# Altium project Length Bar Comparator.PrjPcb (part 3 of 3)

## Sheet Power Regulation.SchDoc
size A3
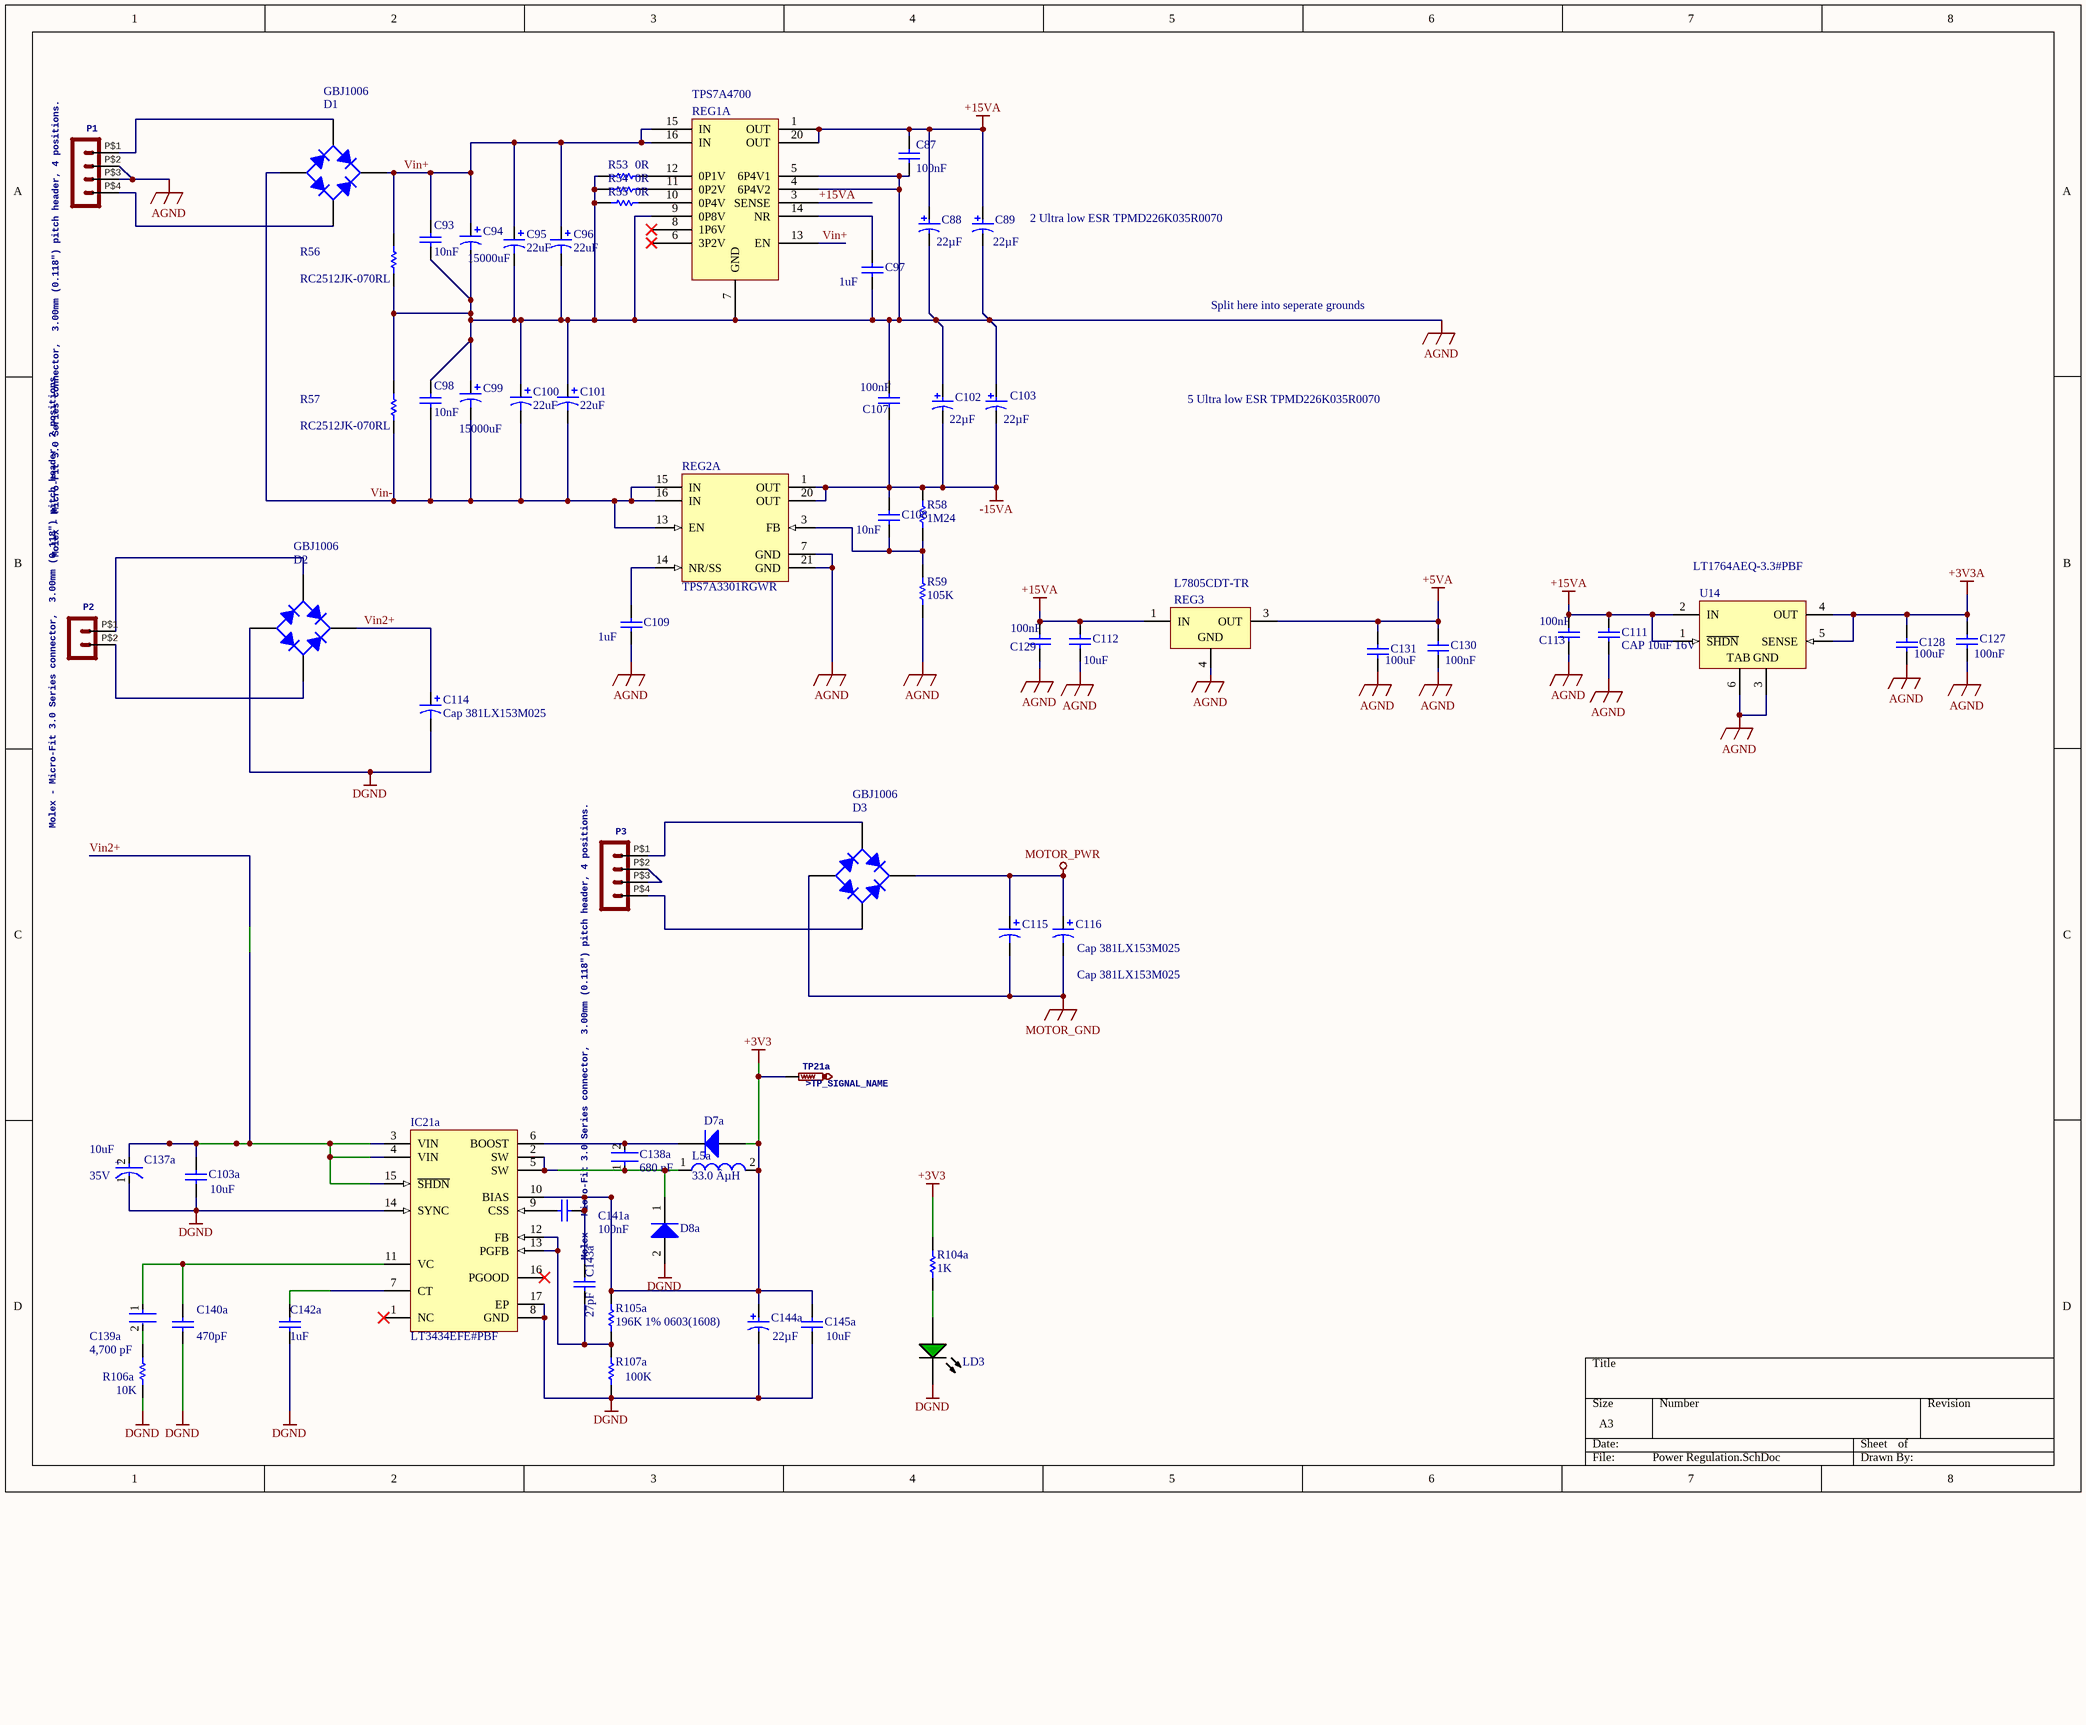
[diagram p9: Power Regulation.SchDoc]

### Parts
C87  value 100nF  [CAPC1206(3216)190_N]  (hidden comment: CAP 100nF 25V 1206(3216))
C88  Capacitance: 22µF  [CAPMP6032X28-T_V]  (hidden comment: TPSC226K025R0275)
C89  Capacitance: 22µF  [CAPMP6032X28-T_V]  (hidden comment: TPSC226K025R0275)
C93  value 10nF  [C0805]  (hidden comment: l)
C94  value 15000uF  [Cap 15000uF]  (hidden comment: Cap 381LX153M025)
C95  22uF  [Case D]
C96  22uF  [Case D]
C97  value 1uF  [C1206]  (hidden comment: l)
C98  value 10nF  [C0805]  (hidden comment: l)
C99  value 15000uF  [Cap 15000uF]  (hidden comment: Cap 381LX153M025)
C100  22uF  [Case D]
C101  22uF  [Case D]
C102  Capacitance: 22µF  [CAPMP6032X28-T_V]  (hidden comment: TPSC226K025R0275)
C103  Capacitance: 22µF  [CAPMP6032X28-T_V]  (hidden comment: TPSC226K025R0275)
C103a  Capacitance: 10uF  [CAPC3225X280X20LL40]  (hidden comment: CGA6P3X7S1H106K250AB)
C107  value 100nF  [CAPC1206(3216)190_N]  (hidden comment: CAP 100nF 25V 1206(3216))
C108  value 10nF  [C0805]  (hidden comment: l)
C109  value 1uF  [C1206]  (hidden comment: l)
C111  CAP 10uF 16V 1210(3225)  [CAPC1210(3225)230_N]
C112  value 10uF  [CAPC1210(3225)230_N]  (hidden comment: CAP 10uF 16V 1210(3225))
C113  value 100nF  [CAPC1206(3216)190_N]  (hidden comment: CAP 100nF 25V 1206(3216))
C114  Cap 381LX153M025  [Cap 15000uF]
C115  Cap 381LX153M025  [Cap 15000uF]
C116  Cap 381LX153M025  [Cap 15000uF]
C127  value 100nF  [CAPC1206(3216)190_N]  (hidden comment: CAP 100nF 25V 1206(3216))
C128  value 100uF  [CAPC1210(3225)280_M]  (hidden comment: CAP 100uF 6.3V 1210(3225))
C129  value 100nF  [CAPC1206(3216)190_N]  (hidden comment: CAP 100nF 25V 1206(3216))
C130  value 100nF  [CAPC1206(3216)190_N]  (hidden comment: CAP 100nF 25V 1206(3216))
C131  value 100uF  [CAPC1210(3225)280_M]  (hidden comment: CAP 100uF 6.3V 1210(3225))
C137a  value 10uF  Voltage Rating: 35V  [FP-TAJD-MFG]  (hidden comment: TAJD106M035RNJ)
C138a  value 680 nF  [FP-CC0603-DA-MFG]  (hidden comment: CC0603KRX7R7BB684)
C139a  value 4,700 pF  [FP-C0603C-CF-MFG]  (hidden comment: C0603C472G5GACTU)
C140a  value 470pF  [CAPC0603(1608)100_M]  (hidden comment: CAP 470pF 50V 0603(1608))
C141a  value 100nF  [CAPC0805(2012)100_L]  (hidden comment: CAP 100nF 16V 0805(2012))
C142a  value 1uF  [CAPC0805(2012)145_N]  (hidden comment: CAP 1uF 6.3V 0805(2012))
C143a  value 27pF  [CAPC0603(1608)100_L]  (hidden comment: CAP 27pF 50V 0603(1608))
C144a  Capacitance: 22µF  [CAPMP6032X28-T_V]  (hidden comment: TPSC226K025R0275)
C145a  Capacitance: 10uF  [CAPC3225X280X20LL40]  (hidden comment: CGA6P3X7S1H106K250AB)
D1  GBJ1006  [DIOD-GBJ-4_V]
D2  GBJ1006  [DIOD-GBJ-4_V]
D3  GBJ1006  [DIOD-GBJ-4_V]
D7a  JANTX1N4148-1  [MCSM-DO-35-2]  (value not drawn)
D8a  MBRS3201T3G  [ONSC-SMC-2-403-03_V]  (value not drawn)
IC21a  LT3434EFE#PBF  [LT-FE-16-EPV-BC_M]
L5a  Inductance: 33.0 ÂµH  [WE-PD-LS]  (hidden comment: 7447715330)
LD3  SML-LXT0805GW-TR  [LUMX-SML-LXT0805_V]  (value not drawn)
P1  Molex - Micro-Fit 3.0 Series connector,  3.00mm (0.118") pitch header, 4 positions.  [43650-0415]
P2  Molex - Micro-Fit 3.0 Series connector,  3.00mm (0.118") pitch header, 2 positions.  [43650-0215]
P3  Molex - Micro-Fit 3.0 Series connector,  3.00mm (0.118") pitch header, 4 positions.  [43650-0415]
R53  Resistance (Ohms): 0R  [RESC1608X55X35LL10T10]  (hidden comment: RC1608J000CS)
R54  Resistance (Ohms): 0R  [RESC1608X55X35LL10T10]  (hidden comment: RC1608J000CS)
R55  Resistance (Ohms): 0R  [RESC1608X55X35LL10T10]  (hidden comment: RC1608J000CS)
R56  RC2512JK-070RL  [RESC6431X65X50LL10T20]
R57  RC2512JK-070RL  [RESC6431X65X50LL10T20]
R58  1M24  [RESC0805(2012)_N]
R59  105K  [RESC0805(2012)_N]
R104a  value 1K  [RESC0805(2012)_M]  (hidden comment: 1K 1% 0805(2012))
R105a  196K 1% 0603(1608)  [RESC0603(1608)_L]
R106a  value 10K  [RESC0805(2012)_L]  (hidden comment: 10K 5% 0805(2012))
R107a  Resistance: 100K  [RESC1608X55X25ML10T15]  (hidden comment: RC0603FR-07100KL)
REG1  TPS7A4700  [RGW0020A_V]  (part A of 2)
REG2  TPS7A3301RGWR  [RGW0020A_V]  (part A of 2)
REG3  L7805CDT-TR  [TO-252_N]
TP21a  TP_SIGNAL_NAME: >TP_SIGNAL_NAME  [P1-13]  (hidden comment: PTR1PAD1-13)
U14  LT1764AEQ-3.3#PBF  [LT-Q-5_L]

### Nets
+3V3: C141a.2 C143a.2 C144a.1 C145a.2 D7a.1(A) IC21a.10(BIAS) L5a.2 R104a.2 R105a.1 TP21a.TP
+3V3A: C127.2 C128.1 U14.4(OUT) U14.5(SENSE)
+5VA: C130.2 C131.1 REG3.3(OUT)
+15VA: C87.2 C88.1 C89.1 C111.1 C112.1 C113.2 C129.2 REG1.1(OUT) REG1.3(SENSE) REG1.20(OUT) REG3.1(IN) U14.1(~{SHDN}) U14.2(IN)
-15VA: C102.2 C103.2 C107.1 C108.2 R58.2 REG2.1(OUT) REG2.20(OUT)
AGND: C87.1 C88.2 C89.2 C93.1 C94.2 C95.2 C96.2 C97.1 C98.2 C99.1 C100.1 C101.1 C102.1 C103.1 C107.2 C109.1 C111.2 C112.2 C113.1 C127.1 C128.2 C129.1 C130.1 C131.2 P1.P$2 P1.P$3 R53.1 R54.1 R55.1 R56.1 R57.2 R59.1 REG1.4(6P4V2) REG1.5(6P4V1) REG1.7(GND) REG1.9(0P8V) REG2.7(GND) REG2.21(GND) REG3.4(GND) U14.3(GND) U14.6(TAB)
DGND: C103a.1 C114.2 C137a.1(C) C140a.1 C142a.1 C144a.2 C145a.1 D2.4(K) D8a.2(A) IC21a.8(GND) IC21a.14(SYNC) IC21a.17(EP) LD3.2(K) R106a.1 R107a.1
MOTOR_GND: C115.2 C116.2 D3.4(K)
MOTOR_PWR: C115.1 C116.1 D3.1(A)
Vin2+: C103a.2 C114.1 C137a.2(A) D2.1(A) IC21a.3(VIN) IC21a.4(VIN) IC21a.15(~{SHDN})
Vin+: C93.2 C94.1 C95.1 C96.1 D1.1(A) R56.2 REG1.13(EN) REG1.15(IN) REG1.16(IN)
Vin-: C98.1 C99.2 C100.2 C101.2 D1.4(K) R57.1 REG2.13(EN) REG2.15(IN) REG2.16(IN)
NetC97_2: C97.2 REG1.14(NR)
NetC108_1: C108.1 R58.1 R59.2 REG2.3(FB)
NetC109_2: C109.2 REG2.14(NR/SS)
NetC138a_1: C138a.1 D8a.1(K) IC21a.2(SW) IC21a.5(SW) L5a.1
NetC138a_2: C138a.2 D7a.2(K) IC21a.6(BOOST)
NetC139a_1: C139a.1 C140a.2 IC21a.11(VC)
NetC139a_2: C139a.2 R106a.2
NetC141a_1: C141a.1 IC21a.9(CSS)
NetC142a_2: C142a.2 IC21a.7(CT)
NetC143a_1: C143a.1 IC21a.12(FB) IC21a.13(PGFB) R105a.2 R107a.2
NetD1_2: D1.2(C) P1.P$1
NetD1_3: D1.3(C) P1.P$4
NetD2_2: D2.2(C) P2.P$1
NetD2_3: D2.3(C) P2.P$2
NetD3_2: D3.2(C) P3.P$1
NetD3_3: D3.3(C) P3.P$4
NetLD3_1: LD3.1(A) R104a.1
NetP3_P$2: P3.P$2 P3.P$3
NetR53_2: R53.2 REG1.12(0P1V)
NetR54_2: R54.2 REG1.11(0P2V)
NetR55_2: R55.2 REG1.10(0P4V)

Not connected (* = marked no-connect by the designer): IC21a 1(NC)* 16(PGOOD)*; REG1 6(3P2V)* 8(1P6V)*

### Notes on the sheet
- (near C89) 2 Ultra low ESR TPMD226K035R0070
- Split here into seperate grounds
- 5 Ultra low ESR TPMD226K035R0070
- (in symbol CMP-04424-000020-1) +

### Library data of the parts
C87 C107 C113 C127 C129 C130 = CMP-1037-04187-1: CAP 100nF 25V ±2% 1206 (3216 Metric) Thickness 1.9mm SMD; Case-EIA: 1206; Tolerance: Â±2%; Case-Metric: 3216; Max Thickness: 1.9 mm; Technology: SMT; Rated Voltage: 25 V
C88 C89 C102 C103 C144a = CMP-2000-07295-1: Low ESR, 22 uF, 25 V, +/- 10%, -55 to 125 degC, 2-Pin SMD, RoHS, Tape and Reel; Manufacturer Size Code: C; Manufacturer: AVX; Voltage - Rated: 25V; Online Catalog: TPSSeries; Product Training Modules: ComponentSolutionsforSmartMeterApplications; ESR (Equivalent Series Resistance): 275mOhm; Featured Product: TPSCapacitors; Other Names: 478-3102-6; Type: Molded; Package / Case: 2312(6032Metric); Lifetime @ Temp.: -; Series: TPS; Datasheet Version: 01/2017; Tolerance: ±10%; Datasheet URL: http://datasheets.avx.com/TPS.pdf; Features: GeneralPurpose; Package Reference: CAPMP06032X28-T; Category: Capacitors; Operating Temperature: -55°C~125°C; Manufacturer URL: http://www.avx.com/; Mounting Technology: SurfaceMount; Package URL: http://www.avx.com/download/software/literature/AVX-Footprint-Library.pdf; Mounting Type: SurfaceMount; Packaging: Digi-Reel®; Package Description: 2-Pin Surface Mount Device, Body 6 x 3.25 mm; Family: TantalumCapacitors; Standard Package: 1; Lead Spacing: -
  C88 C89 C102 C103: Size / Dimension: 0.236"Lx0.126"W(6.00mmx3.20mm); Height - Seated (Max): 0.110"(2.80mm)
C93 C97 C98 C108 C109 = Cap: Capacitor; Published: 8-Jun-2000; LatestRevisionDate: 17-Jul-2002; LatestRevisionNote: Re-released for DXP Platform.; PackageReference: RAD-0.3; Publisher: Altium Limited; PackageDescription: Radial Cap, Thru-Hole; 2 Leads; 0.3 in Pin Spacing
C95 C96 C100 C101 = Polar Capacitor
C103a C145a = CMP-2000-07444-1: Chip Capacitor, 10 uF, +/- 10%, 50 V, -55 to 125 degC, 1210 (3225 Metric), RoHS, Tape and Reel; Manufacturer: TDK; Voltage: 50V; Dielectric: X7S; Case Code (Imperial): 1210; RoHSCompliant: True; Mounting Technology: SurfaceMount; Datasheet Version: 12/2014; Case Code (Metric): 3225; Min Operating Temperature: -55degC; Package Quantity: 1; Case/Package: 1210; Length: 3.2mm; Width: 0.098inch; Termination: SMD/SMT; Lead Free: LeadFree; REACH SVHC: NoSVHC; Height: 2.5mm; Package Description: 2-Pin Surface Mount Device, Body 3.2 x 2.5 mm; Max Operating Temperature: 125degC; Datasheet URL: https://product.tdk.com/info/en/catalog/datasheets/mlcc_automotive_general_en.pdf; Weight: 0.000564oz; Voltage Rating: 50V; Depth: 2.5mm; Thickness: 0.11inch; Package Reference: 1210; Manufacturer URL: http://www.tdk.com/; Voltage Rating (DC): 50V; Tolerance: 10%; Packaging: TapeandReel; Composition: Ceramic
C111 C112 = CMP-1038-02218-1: CAP 10uF 16V ±20% 1210 (3225 Metric) Thickness 2.3mm SMD; Case-Metric: 3225; Tolerance: Â±20%; Case-EIA: 1210; Technology: SMT; Max Thickness: 2.3 mm; Rated Voltage: 16 V
  C111: Value: 10uF
C128 C131 = CMP-1038-02302-1: CAP 100uF 6.3V ±20% 1210 (3225 Metric) Thickness 2.8mm SMD; Tolerance: Â±20%; Case-EIA: 1210; Case-Metric: 3225; Technology: SMT; Rated Voltage: 6.3 V; Max Thickness: 2.8 mm
C137a = CMP-04424-000020-1: CAP TANT 10UF 20% 35V 2917; Manufacturer: AVX; Life: 1000Hours; Esr: 1Ω; Leakage Current: 3.5uA; Material: Tantalum; Dissipation Factor: 6%; Package: TAJD; Lead Free: Yes; Capacitance: 10uF; Device Class L3: Tantalum Capacitors; Digikey Description: CAP TANT 10UF 20% 35V 2917; ComponentLink2URL: http://datasheets.avx.com/TAJ.pdf; Device Class L1: Passive Components; Device Class L2: Capacitors; Category: Cap; Mouser Description: Cap Tant Solid 10uF 35V D CASE 20% (7.3 X 4.3 X 2.9mm) Inward L SMD 7343-31 1 Ohm 125C T/R; Octopart: https://octopart.com/tajd106m035rnj-avx-3819655; ComponentLink2Description: Datasheet; Footprint Url: http://www.avx.com/download/software/literature/AVX-Footprint-Library.pdf; Temperature Range High: +125°C; Automotive: No; Height: 3.1mm; RoHS: TRUE; Manufacturer Part Number: TAJD106M035RNJ; Temperature: -55°C to +125°C; Tolerance: 20%; Temperature Range Low: -55°C
C138a = CMP-03422-000082-1: CAP CER 0.68UF 16V X7R 0603; Manufacturer: YAGEO; Tolerance: 0.1; Temperature Coefficient: 15%; Material: Ceramic; Device Class L3: Ceramic Capacitors; Digikey Description: CAP CER 0.68UF 16V X7R 0603; RoHS: TRUE; Footprint Url: http://www.yageo.com/exep/pages/download/literatures/UPY-C_GEN_24.pdf; ComponentLink2URL: http://www.yageo.com/documents/recent/UPY-GPHC_X7R_6.3V-to-50V_18.pdf; Device Class L1: Passive Components; Temperature Range Low: -55°C; Category: Cap; Mouser Description: 0603 16 V 680 nF X7R ±10% Tolerance Multilayer Ceramic Capacitor; ComponentLink2Description: Datasheet; Temperature Range High: +125°C; Capacitance: 680 nF; Temperature: -55°C to +125°C; Voltage: 16 V; Manufacturer Part Number: CC0603KRX7R7BB684; Automotive: No; Device Class L2: Capacitors; Height: 0.9mm; Lead Free: Yes; Package: CC0603-DA; Temperature Characteristic: X7R; Voltage Rating: 16 V; Octopart: https://octopart.com/cc0603krx7r7bb684-yageo-21707056
C139a = CMP-03020-006967-1: CAP CER 4700PF 50V NP0 0603; Manufacturer: KEMET; Temperature Characteristic: C0G; Tolerance: 0.02; Temperature Coefficient: 30ppm/°C; Automotive Grade: Grade 1; Material: Ceramic; Package: C0603C-CF; Mouser Description: Multilayer Ceramic Capacitors MLCC - SMD/SMT 50volts 4700pF 2% C0G; Lead Free: Yes; Voltage Rating: 50 V; Octopart: https://octopart.com/c0603c472g5gactu-kemet-19050074; ComponentLink2Description: Datasheet; RoHS: TRUE; Category: Cap; Manufacturer Part Number: C0603C472G5GACTU; Capacitance: 4,700 pF; Device Class L3: Ceramic Capacitors; ComponentLink2URL: https://api.kemet.com/component-edge/download/datasheet/C0603C100J5GACAUTO.pdf; Temperature Range Low: -55°C; Temperature: -55°C to +125°C; Device Class L2: Capacitors; Device Class L1: Passive Components; Automotive: Yes; Height: 0.87mm; Temperature Range High: +125°C; Digikey Description: CAP CER 4700PF 50V NP0 0603
C140a = CMP-1035-01675-1: CAP 470pF 50V ±5% 0603 (1608 Metric) Thickness 1mm SMD; Case-Metric: 1608; Tolerance: Â±5%; Case-EIA: 0603; Technology: SMT; Rated Voltage: 50 V; Max Thickness: 1 mm
C141a = CMP-1036-04400-1: CAP 100nF 16V ±5% 0805 (2012 Metric) Thickness 1mm SMD; Case-EIA: 0805; Tolerance: Â±5%; Case-Metric: 2012; Max Thickness: 1 mm; Technology: SMT; Rated Voltage: 16 V
C142a = CMP-1036-04731-1: CAP 1uF 6.3V ±10% 0805 (2012 Metric) Thickness 1.45mm SMD; Case-Metric: 2012; Case-EIA: 0805; Tolerance: Â±10%; Max Thickness: 1.45 mm; Technology: SMT; Rated Voltage: 6.3 V
C143a = CMP-1035-00889-1: CAP 27pF 50V ±10% 0603 (1608 Metric) Thickness 1mm SMD; Case-EIA: 0603; Tolerance: Â±10%; Case-Metric: 1608; Technology: SMT; Rated Voltage: 50 V; Max Thickness: 1 mm
D1-D3 = CMP-1229-00001-1: Glass Passivated Bridge Rectifier, 10 A, -65 to 150 degC, 4-Pin THD (GBJ), Tube; Manufacturer: Diodes Inc; Voltage-Peak Reverse: 600 V Max.; CT: 55 pF; VFM: 1.05 V; VR(RMS): 420 V; IFSM: 170 A; IO: 10 A; ComponentLink1Description: Manufacturer URL; Operating Temperature: -65 to 150 degC; ComponentLink3URL: http://diodes.com/datasheets/ds21218.pdf; DatasheetVersion: Rev. 7; PartNumber: GBJ1006; PackageDescription: 4-Pin Through Hole Device, Body 30 x 4.6 mm, Height 24 mm; ComponentLink3Description: Package Specification; Mounting Technology: Through Hole; ComponentLink2URL: http://diodes.com/datasheets/ds21218.pdf; ComponentLink2Description: Datasheet; Packing: Tube; ComponentLink1URL: http://www.diodes.com/
D7a = CMP-2000-06494-1: Glass Axial Switching Diode, 200 mA, 100 V, 2-Pin DO-35, RoHS, Bulk; Manufacturer: Microsemi; Peak Average Forward Current: 0.2A; Peak Reverse Recovery Time: 5ns; Rad Hard: No; Configuration: Single; Peak Forward Voltage: 1.2@0.1AV; Peak Reverse Repetitive Voltage: 75V; Breakdown Voltage: 100V; Peak Reverse Current: 0.5uA; Operating Temperature: -65to200°C; Package Description: 2-Pin Axial Lead, Dia 1.665 mm, Body Length 4.065 mm; PartNumber: 1N4148-1; Type: SwitchingDiode; Package: 2DO-35; Output Current: 0.2A; Mounting: ThroughHole; Mounting Technology: ThroughHole; Packaging: Bulk; Datasheet Version: Rev. 1, 11/2012; Manufacturer URL: http://www.microsemi.com/; Package Reference: DO-35-2; Datasheet URL: http://www.microsemi.com/document-portal/doc_download/125211-lds-0281
D8a = CMP-1055-00379-1: 200 V, 3 A Schottky Fast Soft-Recovery Power Rectifier, 2-Pin SMC, Pb-Free, Tape and Reel; Manufacturer: On Semiconductor; Configuration: Single; trr Max (ns): 35; IFSM Max (A): 100; PackageDescription: 2-Pin Small Molded Package, J-Bend Lead, Body 5.845 x 6.855 mm; ComponentLink2URL: http://www.onsemi.cn/pub_link/Collateral/MBRS3201T3-D.PDF; Packing: Tape and Reel; DatasheetVersion: Rev. 3; PartNumber: MBRS3201T3G; ComponentLink2Description: Datasheet; ComponentLink1URL: http://www.onsemi.com/; PackageVersion: Rev. E, 08/2005; PackageReference: SMC-2-403-03; ComponentLink1Description: Manufacturer URL; RoHS: TRUE; ComponentLink3Description: Package Specification; ComponentLink3URL: http://www.onsemi.com/pub_link/Collateral/403-03.PDF; Mounting Technology: Surface Mount
IC21a = CMP-0491-00607-1: High Voltage 3 A, 200 kHz Step-Down Switching Regulator with 100 uA Quiescent Current, 16-pin SOP (FE-16-EPV-BC), -40 to 125 degC, Pb-Free; Manufacturer: Linear Technology; Frequency Sync Range: 230kHz - 500kHz; Number of Outputs: 1; Mounting Technology: Surface Mount; DatasheetVersion: Rev. B; ComponentLink3Description: Package Specification; ComponentLink1URL: http://www.linear.com/; PackageDescription: 16-Pin Plastic TSSOP, Body 5 x 4.4 mm, Pitch 0.65 mm; ComponentLink2Description: Datasheet; ComponentLink1Description: Manufacturer URL; ComponentLink2URL: http://cds.linear.com/docs/en/datasheet/3434fb.pdf; PartNumber: LT3434EFE#PBF; ComponentLink3URL: http://cds.linear.com/docs/en/packaging/05081663__J_FE16(BC).pdf; PackageReference: FE-16; PackageVersion: Rev. J, 11/2012; RoHS: TRUE
L5a = CMP-0227-00710-1: SMD-Shielded Power Inductor WE-PD, L = 33.0 µH; PackageDescription: SMD Inductor, 2-Leads, Body 12.0 x 12.0 mm; ComponentLink2URL: http://www.we-online.de/katalog/media/pdf/7447715330.pdf; ComponentLink2Description: Datasheet; PackageVersion: 2008; ComponentLink1Description: Manufacturer Link; ComponentLink1URL: http://www.we-online.com; DatasheetVersion: ver 1, Nov-2008; PackageReference: WE-PD-LS
LD3 = CMP-1724-00001-1: LED, GREEN, 565 nm, 2 V, -25 to 80 degC, 2-Pin SMD, RoHS, Tape and Reel; Case\/Package: 0805; RoHSCompliant: true; REACH SVHC: No SVHC; Packaging: Tape and Reel; ComponentLink2URL: http://www.lumex.com/content/files/ProductAttachment/SML-LXT0805GW-TR.pdf; ComponentLink1URL: http://www.lumexinstruments.com/; Min Operating Temperature: -25 degC; Max Operating Temperature: 85 degC; DatasheetVersion: Rev. F, 09/2009; Case Code (Metric): 2012; Width: 1.25 mm; PackageDescription: 2-Pin Surface Mount Device, Body 2 x 1.25 mm; ComponentLink1Description: Manufacturer URL; Mount: Surface Mount; PackageReference: SML-LXT0805; Length: 2 mm; Case Code (Imperial): 0805; ComponentLink2Description: Datasheet; Package Quantity: 4000; Mounting Technology: Surface Mount
P1 P3 = HEADER_POS4_?43650-0415
P2 = HEADER_POS2_?43650-0215
R53-R55 = CMP-2000-06972-1: Chip Resistor, 0 Ohm, +/- 5%, 0.1 W, -55 to 155 degC, 0603 (1608 Metric), RoHS, Tape and Reel; Manufacturer: Samsung-Electro-Mechanics-America,-Inc.; Power (Watts): 0.1W,1/10W; Tolerance: Jumper; Manufacturer URL: http://www.samsungsem.com/global/index.jsp; Features: MoistureResistant; Mounting Technology: SurfaceMount; Series: RC; Package / Case: 0603(1608Metric); Category: Resistors; Operating Temperature: -55°C~155°C; Datasheet URL: http://static6.arrow.com/aropdfconversion/3cece72dd289ffbadc164fbcd05f638dd7240f7b/rc_datasheet_150330.pdf.pdf?authToken=eyJ0eXAiOiJKV1QiLCJhbGciOiJIUzI1NiJ9.eyJTZXNzaW9uSWQiOiJtY3ZlYXdxYmptZXdpdXdyeG1ha2FxdWciLCJEb3dubG9hZFR5cGUiOiJEYXRhc2hlZXRzIiwiaXNzIjoic2VsZiIsImF1ZCI6Imh0dHA6Ly9kYXRhc2hlZXRhdXRoLmFycm93LmNvbSIsImV4cCI6MTQ3Njg1OTQ5NiwibmJmIjoxNDc2ODU5Mzc2fQ.1rZWSrRNyHkP6J5YmszFzS2kzmlbN9BKNvWJ4ACiP-Q; Datasheet Version: 09/2015; Packaging: Digi-Reel®; Composition: ThickFilm; Package Description: 2-Pin Chip Resistor, Body 1.6 x 0.8 mm; Number of Terminations: 2; Height: 0.022"(0.55mm); Supplier Device Package: 0603; Family: ChipResistor-SurfaceMount; Package Reference: 0603; Temperature Coefficient: -; Size / Dimension: 0.063"Lx0.031"W(1.60mmx0.80mm)
R56 R57 = CMP-2000-06974-1: Chip Resistor, 0 Ohm, Jumper, 1 W, -55 to 125 degC, 2512 (6432 Metric)， RoHS, Tape and Reel; Manufacturer: Yageo; Product Range: RCSeries; Resistor Element Type: ThickFilm; Resistance: 0ohm; Power Rating: 2W; Temperature Coefficient: ±300ppm/°C; Resistor Case Style: 2512[6432Metric]; SVHC: ToBeAdvised; Voltage Rating: 200V; Resistance Tolerance: ±5%; Datasheet URL: http://www.yageo.com/documents/recent/PYu-RC_Group_51_RoHS_L_7.pdf; Package Description: 2-Pin Surface Mount Device, Body 6.35 x 3.1 mm; Manufacturer URL: http://www.yageo.com/; Mounting Technology: SurfaceMount; MSL: MSL1-Unlimited; Datasheet Version: Rev. 7, 05/2017; Packaging: CutTape; Automotive Qualification Standard: -; Package Reference: 2512
R58 R59 = CMP-1013-00849-1: 1M 0.125W 1% 0805 (2012 Metric)  SMD; Value: 1000000.00 Ohm; Case-Metric: 2012; Case-EIA: 0805; Technology: SMT; Power: 0.125 W; Tolerance: 1 %
R104a = CMP-1013-00510-1: 1K 0.125W 1% 0805 (2012 Metric)  SMD; Case-Metric: 2012; Case-EIA: 0805; Tolerance: 1 %; Power: 0.125 W; Technology: SMT
R105a = CMP-1012-00767-1: 196K 0.1W 1% 0603 (1608 Metric)  SMD; Case-EIA: 0603; Value: 196000.00 Ohm; Case-Metric: 1608; Power: 0.1 W; Tolerance: 1 %; Technology: SMT
R106a = CMP-1013-00098-1: 10K 0.125W 5% 0805 (2012 Metric)  SMD; Case-Metric: 2012; Case-EIA: 0805; Tolerance: 5 %; Power: 0.125 W; Technology: SMT
R107a = CMP-2100-03662-1: Chip Resistor, 100 KOhm, +/- 1%, 0.1 W, -55 to 155 degC, 0603 (1608 Metric), RoHS, Tape and Reel; Manufacturer: Yageo; Power Rating: 100mW; Voltage Rating: 50V; Temperature Coefficient: 100ppm/degreesC; Datasheet Version: Rev. 5, 10/2016; Height: 0.45mm; Lead Free: LeadFree; Manufacturer URL: http://www.yageo.com/; Package Reference: 0603; Depth: 0.8mm; RoHSCompliant: true; Composition: ThickFilm; Military Standard: Not; Case/Package: 0603; Packaging: TapeandReel; Case Code (Imperial): 0603; Voltage Rating (DC): 50V; Case Code (Metric): 1608; Tolerance: 1%; Termination: SMD/SMT; Min Operating Temperature: -55degC; Number of Pins: 2; Length: 1.6mm; Width: 0.8mm; Datasheet URL: http://www.yageo.com/NewPortal/yageodocoutput?fileName=/pdf/R-Chip/PYu-RC_Group_51_RoHS_L_5.pdf; Package Description: 2-Pin Surface Mount Device, Body 1.6 x 0.8 mm; Max Operating Temperature: 155degC; REACH SVHC: NoSVHC
REG2 = CMP-0395-01391-2: Single Output High PSRR LDO, 1 A, Adjustable -1.18 to -33 V Output, -3 to -36 V Input, with Ultra-Low Noise, 20-pin VQFN (RGW), -40 to 125 degC, Green (RoHS & no Sb/Br); Manufacturer: Texas Instruments; SubFamily: Single Channel LDO; Vdo(Typ)(mV): 290; Iq(Typ)(mA): 0.21; Iout(Max)(A): 1; Accuracy(%): 1.5; PackageDescription: 20-Pin Plastic Quad Flat No-Pin, 5 x 5 mm Body, 0.65 mm Pitch, 3.15 x 3.15 mm Exposed Pad; DatasheetVersion: SBVS169B; ComponentLink1Description: Manufacturer URL; ComponentLink2Description: Datasheet; PartNumber: TPS7A3301RGWR; Eco-Plan: Green (RoHS & no Sb/Br); Vin(Min)(V): -3; ComponentLink2URL: http://www.ti.com/general/docs/lit/getliterature.tsp?genericPartNumber=TPS7A3301&fileType=pdf; ComponentLink3Description: Package Specification; PackageReference: RGW0020A; Vout Adj(Max)(V): -33; Vin(Max)(V): -36; Vout Adj(Min)(V): -1.18; ComponentLink1URL: http://www.ti.com/; Code_JEDEC: MO-220; ComponentLink3URL: http://www.ti.com/litv/pdf/mpqf122b; Mounting Technology: Surface Mount; PartId: 1
REG3 = CMP-0244-00216-1: Positive Voltage Regulator, 3-Pin DPAK, Tape and Reel; PackageVersion: 2011; PackageReference: TO-252; DatasheetVersion: 16/11/2011; PackageDescription: 3-Pin Transistor Outline Package 2.28 mm Pitch, 9.7 mm Lead Span (DPAK); ComponentLink1URL: http://www.st.com; ComponentLink2Description: Datasheet; ComponentLink1Description: Manufacturer URL; ComponentLink2URL: http://www.st.com/internet/com/TECHNICAL_RESOURCES/TECHNICAL_LITERATURE/DATASHEET/CD00000444.pdf
TP21a = PTR1PAD1-13: TEST PIN
U14 = CMP-0476-01176-1: 3 A, Fast Transient Response, Low Noise, LDO Regulator, 2.7 to 20 V Vin, 3.3 V Vout, 5-pin DPAK (Q-5), -40 to 125 degC, Pb-Free; Manufacturer: Linear Technology; Number of Outputs: 1; Noise(uV): 40; Output Voltage: 3.3 V; Shutdown Current(uA): 0.01; PSRR(dB): 63; Dropout Voltage(V): 0.34; Vin Min(V): 2.7; Iout(mA): 3000; Vin Max(V): 20; Discrete Pass Element: no; ComponentLink3URL: http://cds.linear.com/docs/en/packaging/Q%20DD5%2005-08-1461%20Rev%20F.pdf; ComponentLink1URL: http://www.linear.com/; ComponentLink3Description: Package Specification; Mounting Technology: Surface Mount; PackageReference: Q-5; PackageVersion: Rev. F, 09/2011; RoHS: TRUE; Isupply(mA): 1; ComponentLink2Description: Datasheet; PackageDescription: 5-Pin Plastic DD Pak, Body 10.2235 x 8.89 mm, Pitch 1.702 mm; ComponentLink2URL: http://cds.linear.com/docs/en/datasheet/1764afb.pdf; PartNumber: LT1764AEQ-3.3#PBF; ComponentLink1Description: Manufacturer URL; DatasheetVersion: Rev. B

## Sheet Reference Voltage.SchDoc
size A4
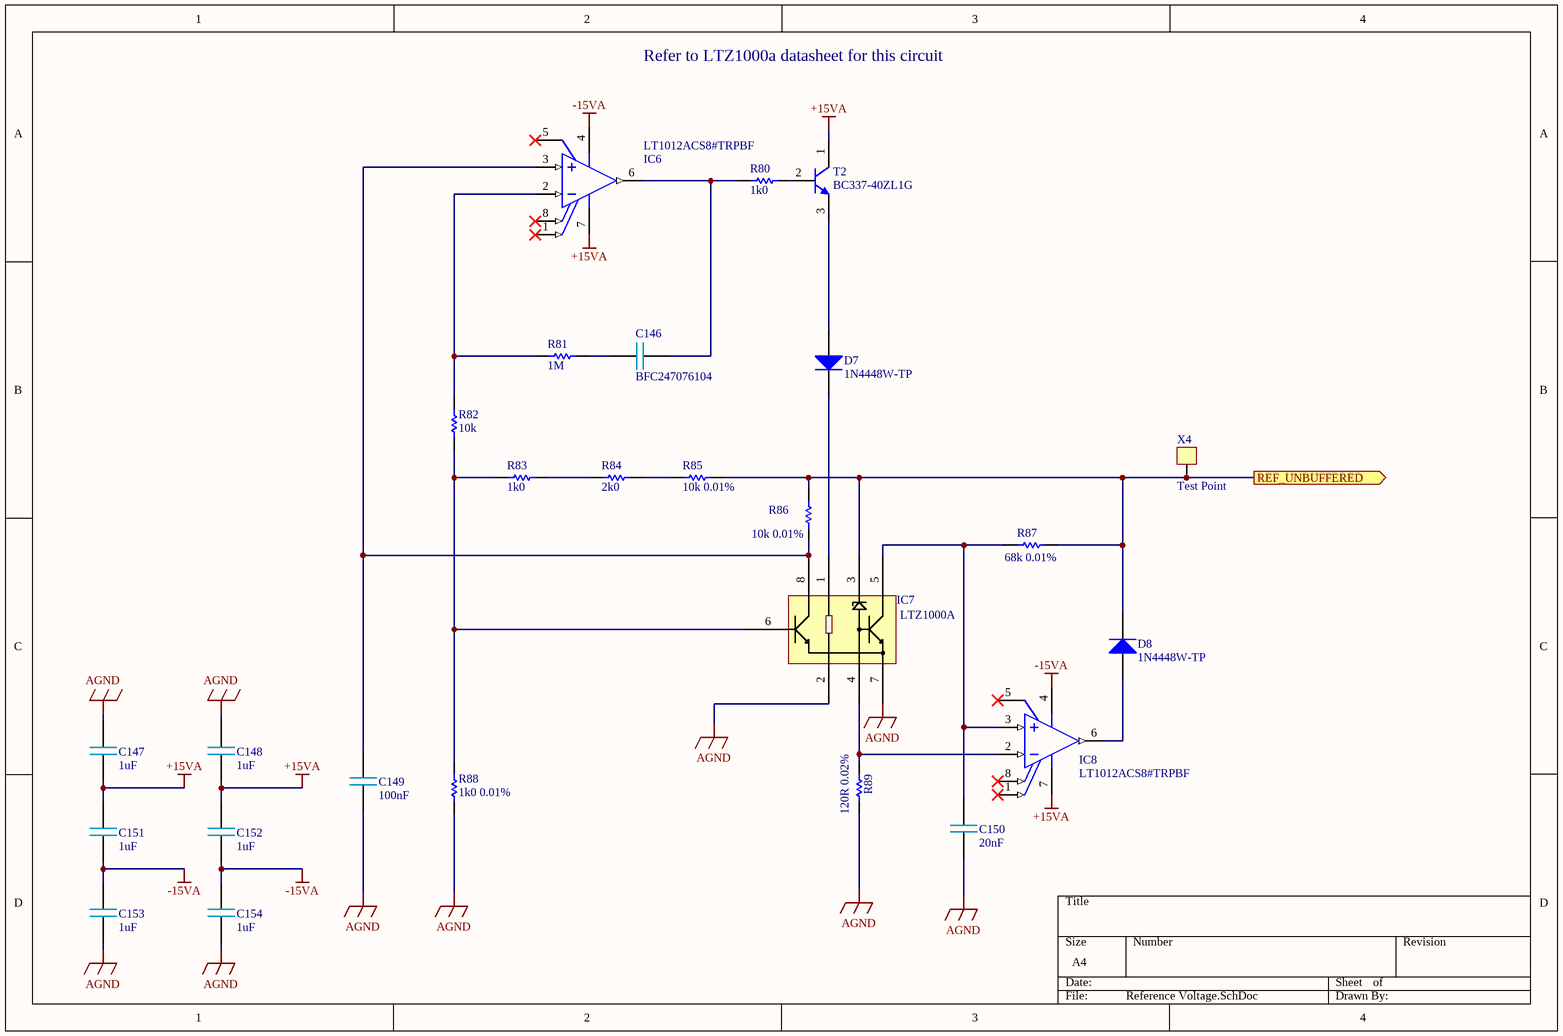
[diagram p10: Reference Voltage.SchDoc]

### Parts
C146  BFC247076104  [Cap 5mm polyester]
C147  1uF  [Capacitor 7mmx3mm 5mm pitch]
C148  1uF  [Capacitor 7mmx3mm 5mm pitch]
C149  100nF  [Cap 5mm polyester]
C150  20nF  [Cap 5mm polyester]
C151  1uF  [Capacitor 7mmx3mm 5mm pitch]
C152  1uF  [Capacitor 7mmx3mm 5mm pitch]
C153  1uF  [Capacitor 7mmx3mm 5mm pitch]
C154  1uF  [Capacitor 7mmx3mm 5mm pitch]
D7  1N4448W-TP  [MCC-SOD123_V]
D8  1N4448W-TP  [MCC-SOD123_V]
IC6  LT1012ACS8#TRPBF  [LT-S8-8_M]
IC7  LTZ1000A  [H-08A]
IC8  LT1012ACS8#TRPBF  [LT-S8-8_M]
R80  1k0  [RESC3116X65X40LL10T20]
R81  1M  [RESC0805(2012)_N]
R82  10k  [RESC3116X65X40LL10T20]
R83  1k0  [RESC0805(2012)_N]
R84  2k0  [RESC0805(2012)_N]
R85  10k 0.01%  [RESC3116X65X40LL10T20]
R86  10k 0.01%  [RESC3116X65X40LL10T20]
R87  68k 0.01%  [RESC3116X65X40LL10T20]
R88  1k0 0.01%  [RESC3116X65X40LL10T20]
R89  120R 0.02%  [RESC3116X65X40LL10T20]
T2  BC337-40ZL1G  [ONSC-TO-92-3-29-11_AM_BL]
X4  Test Point  [Test Point]

### Ports
REF_UNBUFFERED (out)

### Nets
+15VA: C147.2 C148.2 C151.1 C152.1 IC6.7(V+) IC8.7(V+) T2.1(C)
-15VA: C151.2 C152.2 C153.1 C154.1 IC6.4(V-) IC8.4(V-)
AGND: C147.1 C148.1 C149.1 C150.1 C153.2 C154.2 IC7.2 IC7.7 R88.1 R89.1
NetC146_1: C146.1 R81.2
NetC146_2: C146.2 IC6.6(OUT) R80.1
NetC149_2: C149.2 IC6.3(+IN) IC7.8 R86.1
NetC150_2: C150.2 IC7.5 IC8.3(+IN) R87.2
NetD7_1: D7.1(A) T2.3(E)
NetD7_2: D7.2(K) IC7.1
NetD8_1: D8.1(A) IC8.6(OUT)
NetD8_2: D8.2(K) IC7.3 R85.2 R86.2 R87.1 X4.1 ; port REF_UNBUFFERED
NetIC6_2: IC6.2(-IN) R81.1 R82.1
NetIC7_4: IC7.4 IC8.2(-IN) R89.2
NetIC7_6: IC7.6 R82.2 R83.1 R88.2
NetR80_2: R80.2 T2.2(B)
NetR83_2: R83.2 R84.1
NetR84_2: R84.2 R85.1

Not connected (* = marked no-connect by the designer): IC6 1(VOS_TRIM)* 5(OVER_COMP)* 8(VOS_TRIM)*; IC8 1(VOS_TRIM)* 5(OVER_COMP)* 8(VOS_TRIM)*

### Notes on the sheet
- Refer to LTZ1000a datasheet for this circuit

### Library data of the parts
C147-C154 = BFC247076104
D7 D8 = CMP-0862-00001-1: Switching Diode, 500 mW, 100 V, -55 to 150 degC, SOD123, RoHS, Tape and Reel; Manufacturer: Micro Commercial Components; FV: 1 V Max.; Trr: 4 nS; IF (AV): 250 mA; VRM (PRV): 100 V; PD: 500 mW; Typical Junction Capacitance: 4 pF; IR: 25 nA; ComponentLink1Description: Manufacturer URL; PackageVersion: Rev. C; ComponentLink2URL: http://www.mccsemi.com/up_pdf/1N4448W(SOD-123).pdf; DatasheetVersion: Rev. C; ComponentLink3Description: Package Specification; PackageDescription: 2-Pin SOD123, Body 2.7 x 1.6 mm, Height 1.35 mm; ComponentLink3URL: http://www.mccsemi.com/up_pdf/1N4448W(SOD-123).pdf; Operating Temperature Range: -55 to 150 degC; PackageReference: SOD123; PartNumber: 1N4448W-TP; Packing: Tape and Reel; ComponentLink1URL: http://www.mccsemi.com/; RoHS: TRUE; ComponentLink2Description: Datasheet; Mounting Technology: Surface Mount
IC6 IC8 = CMP-0359-03028-2: Single Channel, Low Vos Stable Operational Amplifier, 1 MHz Typical GBW, 0.2 V/us Typical SR, 2.4 to 40 V, 8-Pin SOIC (S8-8), Commerical, Pb-Free, Reel; Linear Technology Part Number: LT1012; Manufacturer: Linear Technology; Channels (#): 1; Is (mA) Typical: 0.37; Vos (mV) Typical: 0.008; Vs Max (V): 40; SR (V/us) Typical: 0.2; Vs Min (V): 2.4; RoHS: Pb-Free; PackageVersion: Rev G; ComponentLink2Description: Datasheet; Mounting Technology: Surface Mount; Type: VFB; ComponentLink3Description: Package Specification; DatasheetVersion: Rev. B; RevisionNote: URLs updated; PackageDescription: 8-Pin Plastic Small Outline, Body 4.9 x 3.9 mm, Pitch 1.27 mm; Packing: Reel; GBW (MHz) Typical: 1; ComponentLink1Description: Manufacturer URL; ComponentLink1URL: http://www.linear.com/; ComponentLink3URL: http://cds.linear.com/docs/en/packaging/05081610_G_SO8.pdf; PartNumber: LT1012ACS8#TRPBF; ComponentLink2URL: http://cds.linear.com/docs/en/datasheet/1012afbs.pdf; PackageReference: LT-S8-8
R80 R82 R85-R89 = CMP-2003-03538-1: Manufacturer: Yageo; Part Number: RC1206FR-0710K2L
R81 R83 R84 = CMP-1013-00849-1: as R58 on sheet Power Regulation; Technology: SMT; Power: 0.125 W; Tolerance: 1 %
T2 = CMP-1048-01583-1: Amplifier Transistor, NPN Silicon, 3-Pin TO-92, Pb-Free, Ammo Box; Manufacturer: On Semiconductor; IC Continuous (A): 0.8; ComponentLink2URL: http://www.onsemi.com/pub_link/Collateral/BC337-D.PDF; PackageReference: TO-92-3-29-11_AM_BL; ComponentLink1Description: Manufacturer URL; PartNumber: BC337-40ZL1G; RoHS: TRUE; PackageVersion: Rev. AM; ComponentLink3URL: http://www.onsemi.com/pub_link/Collateral/MAC97-D.PDF; ComponentLink3Description: Package Specification; Packing: Ammo Box; DatasheetVersion: Rev. 8; Polarity: NPN; ComponentLink1URL: http://www.onsemi.com/; ComponentLink2Description: Datasheet; PackageDescription: 3-Pin Transistor Outline, Body 4.825 x 3.685 mm, Pitch 1.27 mm; Mounting Technology: Through Hole

## Sheet Amplifiers.SchDoc
size A4
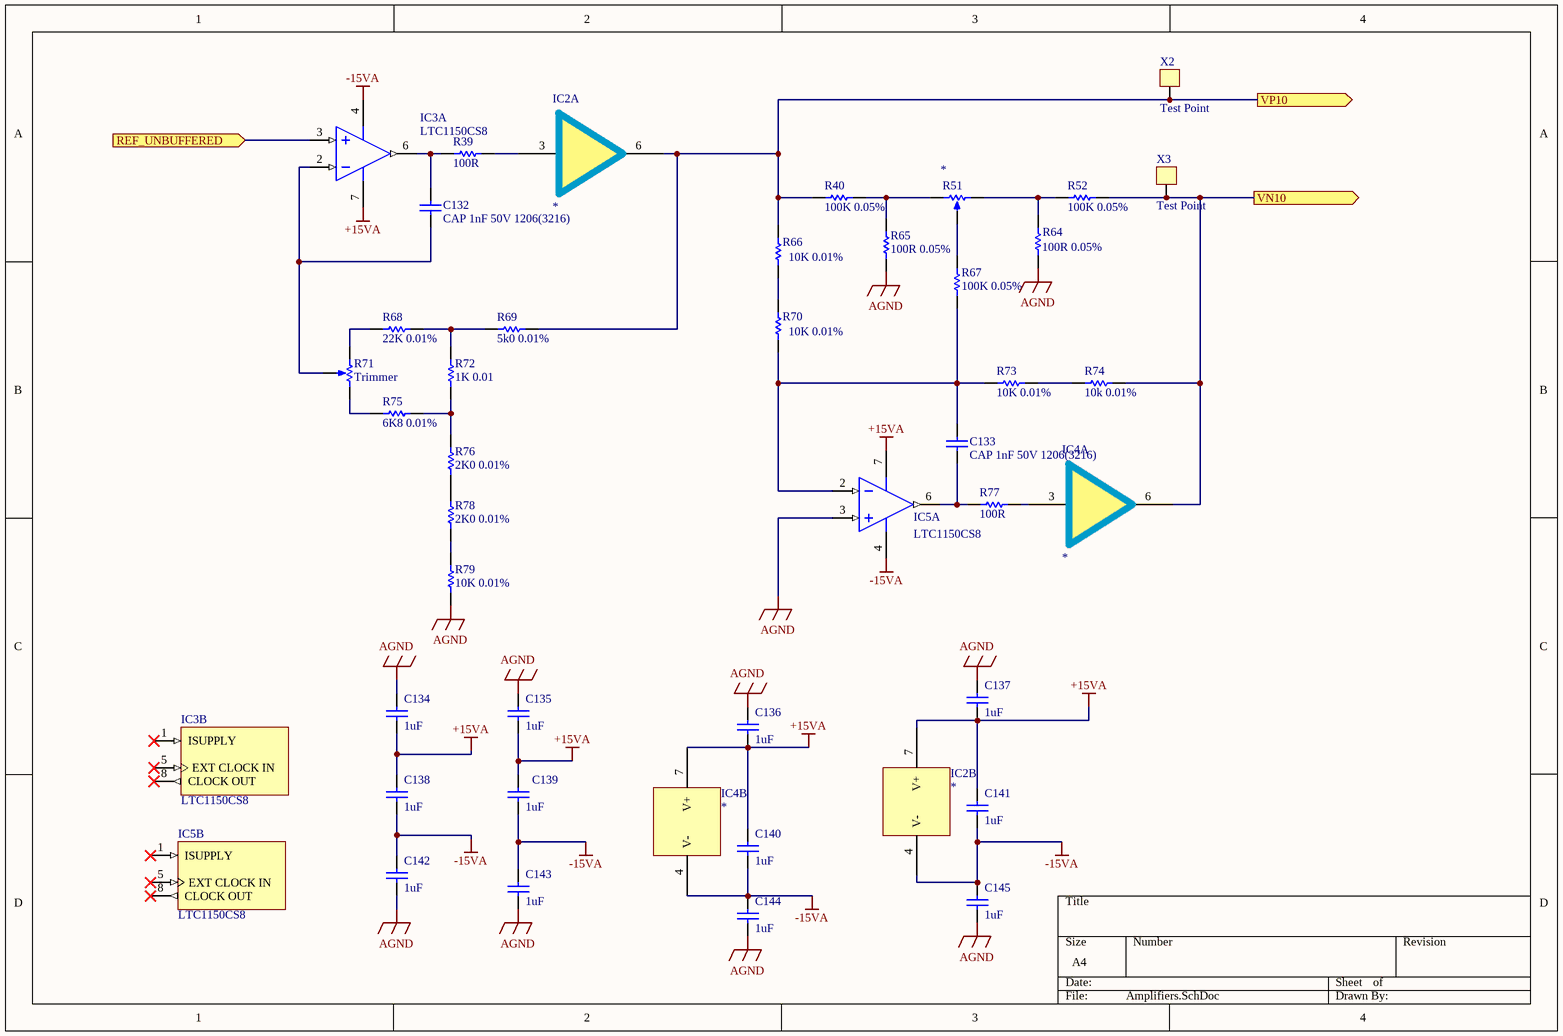
[diagram p11: Amplifiers.SchDoc]

### Parts
C132  CAP 1nF 50V 1206(3216)  [CAPC1206(3216)100_N]
C133  CAP 1nF 50V 1206(3216)  [CAPC1206(3216)100_N]
C134  value 1uF  [CAPC1206(3216)110_N]  (hidden comment: CAP 1uF 50V 1206(3216))
C135  value 1uF  [CAPC1206(3216)110_N]  (hidden comment: CAP 1uF 50V 1206(3216))
C136  value 1uF  [CAPC1206(3216)110_N]  (hidden comment: CAP 1uF 50V 1206(3216))
C137  value 1uF  [CAPC1206(3216)110_N]  (hidden comment: CAP 1uF 50V 1206(3216))
C138  value 1uF  [CAPC1206(3216)110_N]  (hidden comment: CAP 1uF 50V 1206(3216))
C139  value 1uF  [CAPC1206(3216)110_N]  (hidden comment: CAP 1uF 50V 1206(3216))
C140  value 1uF  [CAPC1206(3216)110_N]  (hidden comment: CAP 1uF 50V 1206(3216))
C141  value 1uF  [CAPC1206(3216)110_N]  (hidden comment: CAP 1uF 50V 1206(3216))
C142  value 1uF  [CAPC1206(3216)110_N]  (hidden comment: CAP 1uF 50V 1206(3216))
C143  value 1uF  [CAPC1206(3216)110_N]  (hidden comment: CAP 1uF 50V 1206(3216))
C144  value 1uF  [CAPC1206(3216)110_N]  (hidden comment: CAP 1uF 50V 1206(3216))
C145  value 1uF  [CAPC1206(3216)110_N]  (hidden comment: CAP 1uF 50V 1206(3216))
IC2  *  [SO8_L]  (parts A,B of 3)
IC3  LTC1150CS8  [LT-S8-8_M]  (parts A,B of 2)
IC4  *  [SO8_L]  (parts A,B of 3)
IC5  LTC1150CS8  [LT-S8-8_M]  (parts A,B of 2)
R39  100R  [RESC0805(2012)_N]
R40  100K 0.05%  [RESC0805(2012)_N]
R51  *  [TrimPot]
R52  100K 0.05%  [RESC0805(2012)_N]
R64  100R 0.05%  [RESC0805(2012)_N]
R65  100R 0.05%  [RESC0805(2012)_N]
R66  10K 0.01%  [RESC3116X65X40LL10T20]
R67  100K 0.05%  [RESC0805(2012)_N]
R68  22K 0.01%  [RESC0805(2012)_N]
R69  5k0 0.01%  [RESC0805(2012)_N]
R70  10K 0.01%  [RESC3116X65X40LL10T20]
R71  Trimmer  [TrimPot]
R72  1K 0.01  [RESC3116X65X40LL10T20]
R73  10K 0.01%  [RESC3116X65X40LL10T20]
R74  10k 0.01%  [RESC3116X65X40LL10T20]
R75  6K8 0.01%  [RESC0805(2012)_N]
R76  2K0 0.01%  [RESC0805(2012)_N]
R77  100R  [RESC0805(2012)_N]
R78  2K0 0.01%  [RESC0805(2012)_N]
R79  10K 0.01%  [RESC3116X65X40LL10T20]
X2  Test Point  [Test Point]
X3  Test Point  [Test Point]

### Ports
REF_UNBUFFERED (in), VN10 (out), VP10 (out)

### Nets
+15VA: C134.1 C135.1 C136.1 C137.1 C138.2 C139.2 C140.2 C141.2 IC2.7(V+) IC3.7(V+) IC4.7(V+) IC5.7(V+)
-15VA: C138.1 C139.1 C140.1 C141.1 C142.2 C143.2 C144.2 C145.2 IC2.4(V-) IC3.4(V-) IC4.4(V-) IC5.4(V-)
AGND: C134.2 C135.2 C136.2 C137.2 C142.1 C143.1 C144.1 C145.1 IC5.3(+IN) R64.2 R65.2 R79.1
NetC58_2: IC4.6(Out) R52.2 R74.1 X3.1 ; port VN10
NetC59_2: IC2.6(Out) R40.1 R66.2 R69.2 X2.1 ; port VP10
NetC132_1: C132.1 IC3.6(OUT) R39.1
NetC132_2: C132.2 IC3.2(-IN) R71.3(TAP)
NetC133_1: C133.1 IC5.2(-IN) R67.1 R70.1 R73.2
NetC133_2: C133.2 IC5.6(OUT) R77.1
NetD8_2: IC3.3(+IN) ; port REF_UNBUFFERED
NetIC2_3: IC2.3(In) R39.2
NetIC4_3: IC4.3(In) R77.2
NetR40_2: R40.2 R51.1(TOP) R65.1
NetR51_2: R51.2(BOT) R52.1 R64.1
NetR51_3: R51.3(TAP) R67.2
NetR66_1: R66.1 R70.2
NetR68_1: R68.1 R71.1(TOP)
NetR68_2: R68.2 R69.1 R72.2
NetR71_2: R71.2(BOT) R75.1
NetR72_1: R72.1 R75.2 R76.2
NetR73_1: R73.1 R74.2
NetR76_1: R76.1 R78.2
NetR78_1: R78.1 R79.2

Not connected (* = marked no-connect by the designer): IC3 1(ISUPPLY)* 5(EXT_CLOCK_IN)* 8(CLOCK_OUT)*; IC5 1(ISUPPLY)* 5(EXT_CLOCK_IN)* 8(CLOCK_OUT)*

### Library data of the parts
C132 C133 = CMP-1037-02455-1: CAP 1nF 50V ±20% 1206 (3216 Metric) Thickness 1mm SMD; Case-Metric: 3216; Tolerance: Â±20%; Case-EIA: 1206; Rated Voltage: 50 V; Value: 1nF; Max Thickness: 1 mm; Technology: SMT
C134-C145 = CMP-1037-04724-1: CAP 1uF 50V -20% to +80% 1206 (3216 Metric) Thickness 1.05mm SMD; Case-EIA: 1206; Case-Metric: 3216; Rated Voltage: 50 V; Tolerance: -20% to +80%; Max Thickness: 1.05 mm; Technology: SMT
IC2 IC4 = BUF634
IC3 IC5 = CMP-0359-03090-2: Single Channel, Zero-Drift Operational Amplifier with Internal Capacitors, 2.5 MHz Typical GBW, 3 V/us Typical SR, 4.75 to 32 V, 8-Pin SOIC (S8-8), Commercial; Manufacturer: Linear Technology; GBW (MHz) Typical: 2.5; SR (V/us) Typical: 3; Is (mA) Typical: 0.8; Vos (mV) Typical: 0.0005; Channels (#): 1; Vs Min (V): 4.75; Vs Max (V): 32; ComponentLink3Description: Package Specification; PackageReference: LT-S8-8; DatasheetVersion: Rev. B; PartNumber: LTC1150CS8; Mounting Technology: Surface Mount; ComponentLink1Description: Manufacturer URL; RevisionNote: URLs updated; ComponentLink2URL: http://cds.linear.com/docs/en/datasheet/1150fb.pdf; PackageVersion: Rev G; ComponentLink1URL: http://www.linear.com/; ComponentLink3URL: http://cds.linear.com/docs/en/packaging/05081610_G_SO8.pdf; Linear Technology Part Number: LTC1150; Type: ZD; PackageDescription: 8-Pin Plastic Small Outline, Body 4.9 x 3.9 mm, Pitch 1.27 mm; ComponentLink2Description: Datasheet
R39 R40 R52 R64 R65 R67-R69 R75-R78 = CMP-1013-00849-1: as R58 on sheet Power Regulation; Technology: SMT; Power: 0.125 W; Tolerance: 1 %
R51 R71 = Vishay Trimmer
R66 R70 R72-R74 R79 = CMP-2003-03538-1: as R80 on sheet Reference Voltage

## Nets that join several sheets
+3V3: Stepping Motor DriverA (C5_1.2 R3_1.2 U1_1.11), Stepping Motor DriverB (C5_2.2 R3_2.2 U1_2.11), Stepping Motor DriverC (C5_3.2 R3_3.2 U1_3.11), Stepping Motor DriverD (C5_4.2 R3_4.2 U1_4.11), Stepping Motor DriverE (C5_5.2 R3_5.2 U1_5.11), Stepping Motor DriverF (C5_6.2 R3_6.2 U1_6.11), Microprocessor (50 pins), LVDT Driver (C110.1 U12.1), Power Regulation (10 pins)
+3V3A: LVDT Driver (L11.1 U12.10), Power Regulation (C127.2 C128.1 U14.4 U14.5)
+5VA: Microprocessor (16 pins), Power Regulation (C130.2 C131.1 REG3.3)
+15VA: Microprocessor (14 pins), LVDT Driver (8 pins), Power Regulation (13 pins), Reference Voltage (7 pins), Amplifiers (12 pins)
-15VA: Microprocessor (18 pins), Power Regulation (7 pins), Reference Voltage (6 pins), Amplifiers (12 pins)
AGND: Microprocessor (38 pins), LVDT Driver (28 pins), Power Regulation (41 pins), Reference Voltage (10 pins), Amplifiers (12 pins)
DGND: Stepping Motor DriverA (9 pins), Stepping Motor DriverB (9 pins), Stepping Motor DriverC (9 pins), Stepping Motor DriverD (9 pins), Stepping Motor DriverE (9 pins), Stepping Motor DriverF (9 pins), Microprocessor (81 pins), LVDT Driver (C110.2 U12.2 U12.8), Power Regulation (15 pins)
MOTOR_GND: Stepping Motor DriverA (6 pins), Stepping Motor DriverB (6 pins), Stepping Motor DriverC (6 pins), Stepping Motor DriverD (6 pins), Stepping Motor DriverE (6 pins), Stepping Motor DriverF (6 pins), Power Regulation (C115.2 C116.2 D3.4)
MOTOR_PWR: Stepping Motor DriverA (D1_1.1 D1_1.3), Stepping Motor DriverB (D1_2.1 D1_2.3), Stepping Motor DriverC (D1_3.1 D1_3.3), Stepping Motor DriverD (D1_4.1 D1_4.3), Stepping Motor DriverE (D1_5.1 D1_5.3), Stepping Motor DriverF (D1_6.1 D1_6.3), Power Regulation (C115.1 C116.1 D3.1)
MISO: Stepping Motor DriverA (U1_1.24), Stepping Motor DriverB (U1_2.24), Stepping Motor DriverC (U1_3.24), Stepping Motor DriverD (U1_4.24), Stepping Motor DriverE (U1_5.24), Stepping Motor DriverF (U1_6.24), Microprocessor (7 pins), LVDT Driver (U12.6)
MOSI: Stepping Motor DriverA (U1_1.23), Stepping Motor DriverB (U1_2.23), Stepping Motor DriverC (U1_3.23), Stepping Motor DriverD (U1_4.23), Stepping Motor DriverE (U1_5.23), Stepping Motor DriverF (U1_6.23), Microprocessor (6 pins), LVDT Driver (U12.3)
NetC6_1_2: Stepping Motor DriverA (C6_1.2 R6_1.1), Microprocessor (U10.85)
NetC6_2_2: Stepping Motor DriverB (C6_2.2 R6_2.1), Microprocessor (U10.84)
NetC6_3_2: Stepping Motor DriverC (C6_3.2 R6_3.1), Microprocessor (U10.83)
NetC6_4_2: Stepping Motor DriverD (C6_4.2 R6_4.1), Microprocessor (U10.82)
NetC6_5_2: Stepping Motor DriverE (C6_5.2 R6_5.1), Microprocessor (U10.81)
NetC6_6_2: Stepping Motor DriverF (C6_6.2 R6_6.1), Microprocessor (U10.80)
NetC58_2: Microprocessor (C58.2 U3.16 U8.16), Amplifiers (IC4.6 R52.2 R74.1 X3.1)
NetC59_2: Microprocessor (C59.2 U3.2 U8.2), Amplifiers (5 pins)
NetD8_2: Reference Voltage (6 pins), Amplifiers (IC3.3)
NetU1_1_15: Stepping Motor DriverA (U1_1.15), Microprocessor (U10.138)
NetU1_1_16: Stepping Motor DriverA (U1_1.16), Microprocessor (U10.136)
NetU1_1_17: Stepping Motor DriverA (U1_1.17), Microprocessor (U10.137)
NetU1_1_22: Stepping Motor DriverA (U1_1.22), Microprocessor (U10.133)
NetU1_1_26: Stepping Motor DriverA (U1_1.26), Microprocessor (U10.134)
NetU1_1_27: Stepping Motor DriverA (U1_1.27), Microprocessor (U10.135)
NetU1_2_15: Stepping Motor DriverB (U1_2.15), Microprocessor (U10.128)
NetU1_2_16: Stepping Motor DriverB (U1_2.16), Microprocessor (U10.123)
NetU1_2_17: Stepping Motor DriverB (U1_2.17), Microprocessor (U10.127)
NetU1_2_18: Stepping Motor DriverB (U1_2.18), Microprocessor (U10.129)
NetU1_2_22: Stepping Motor DriverB (U1_2.22), Microprocessor (U10.131)
NetU1_2_26: Stepping Motor DriverB (U1_2.26), Microprocessor (U10.121)
NetU1_2_27: Stepping Motor DriverB (U1_2.27), Microprocessor (U10.122)
NetU1_3_15: Stepping Motor DriverC (U1_3.15), Microprocessor (U10.66)
NetU1_3_16: Stepping Motor DriverC (U1_3.16), Microprocessor (U10.64)
NetU1_3_17: Stepping Motor DriverC (U1_3.17), Microprocessor (U10.65)
NetU1_3_18: Stepping Motor DriverC (U1_3.18), Microprocessor (U10.67)
NetU1_3_22: Stepping Motor DriverC (U1_3.22), Microprocessor (U10.59)
NetU1_3_26: Stepping Motor DriverC (U1_3.26), Microprocessor (U10.60)
NetU1_3_27: Stepping Motor DriverC (U1_3.27), Microprocessor (U10.63)
NetU1_4_15: Stepping Motor DriverD (U1_4.15), Microprocessor (U10.94)
NetU1_4_16: Stepping Motor DriverD (U1_4.16), Microprocessor (U10.92)
NetU1_4_17: Stepping Motor DriverD (U1_4.17), Microprocessor (U10.93)
NetU1_4_18: Stepping Motor DriverD (U1_4.18), Microprocessor (U10.95)
NetU1_4_22: Stepping Motor DriverD (U1_4.22), Microprocessor (U10.89)
NetU1_4_26: Stepping Motor DriverD (U1_4.26), Microprocessor (U10.90)
NetU1_4_27: Stepping Motor DriverD (U1_4.27), Microprocessor (U10.91)
NetU1_5_15: Stepping Motor DriverE (U1_5.15), Microprocessor (U10.100)
NetU1_5_16: Stepping Motor DriverE (U1_5.16), Microprocessor (U10.98)
NetU1_5_17: Stepping Motor DriverE (U1_5.17), Microprocessor (U10.99)
NetU1_5_18: Stepping Motor DriverE (U1_5.18), Microprocessor (U10.101)
NetU1_5_22: Stepping Motor DriverE (U1_5.22), Microprocessor (U10.102)
NetU1_5_26: Stepping Motor DriverE (U1_5.26), Microprocessor (U10.96)
NetU1_5_27: Stepping Motor DriverE (U1_5.27), Microprocessor (U10.97)
NetU1_6_15: Stepping Motor DriverF (U1_6.15), Microprocessor (U10.119)
NetU1_6_16: Stepping Motor DriverF (U1_6.16), Microprocessor (U10.114)
NetU1_6_17: Stepping Motor DriverF (U1_6.17), Microprocessor (U10.118)
NetU1_6_18: Stepping Motor DriverF (U1_6.18), Microprocessor (U10.120)
NetU1_6_22: Stepping Motor DriverF (U1_6.22), Microprocessor (U10.112)
NetU1_6_26: Stepping Motor DriverF (U1_6.26), Microprocessor (U10.113)
NetU1_6_27: Stepping Motor DriverF (U1_6.27), Microprocessor (U10.115)
NetU10_88: Microprocessor (U10.88), LVDT Driver (U12.5)
SCLK: Stepping Motor DriverA (U1_1.21), Stepping Motor DriverB (U1_2.21), Stepping Motor DriverC (U1_3.21), Stepping Motor DriverD (U1_4.21), Stepping Motor DriverE (U1_5.21), Stepping Motor DriverF (U1_6.21), Microprocessor (6 pins), LVDT Driver (U12.4)